# Altium schematic sheet SPI_SCH.SchDoc
size A
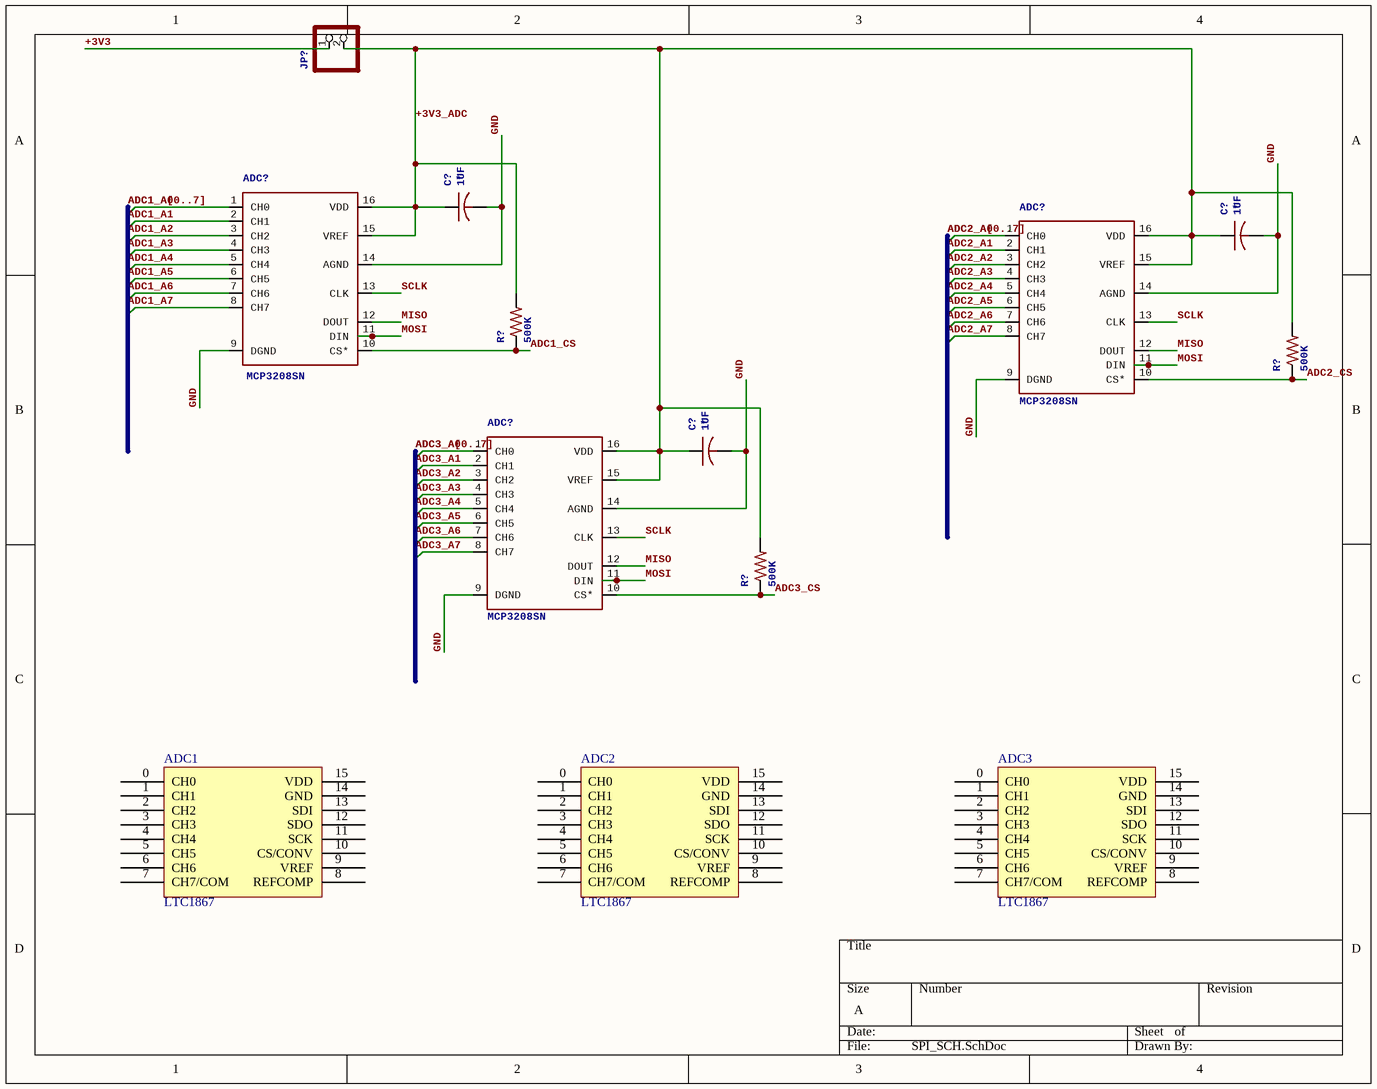
[diagram p0: SPI_SCH.SchDoc]

## Parts
(Parts that share a designator on the sheet are numbered #1, #2 ... from top to bottom, then left to right.)
ADC1  LTC1867
ADC2  LTC1867
ADC3  LTC1867
ADC?#1  MCP3208SN  [SO-16]
ADC?#2  MCP3208SN  [SO-16]
ADC?#3  MCP3208SN  [SO-16]
C?#1  1UF  [C0805]
C?#2  1UF  [C0805]
C?#3  1UF  [C0805]
JP?  PINHD-1X2  [1X02]  (value not drawn)
R?#1  500K  [R0805]
R?#2  500K  [R0805]
R?#3  500K  [R0805]

## Nets
+3V3: JP?.1
+3V3_ADC: ADC?#1.15(VREF) ADC?#1.16(VDD) ADC?#2.15(VREF) ADC?#2.16(VDD) ADC?#3.15(VREF) ADC?#3.16(VDD) C?#1.1 C?#2.1 C?#3.1 JP?.2 R?#1.2 R?#2.2 R?#3.2
ADC1_CS: ADC?#1.10(CS*) R?#1.1
ADC2_CS: ADC?#2.10(CS*) R?#2.1
ADC3_CS: ADC?#3.10(CS*) R?#3.1
GND: ADC?#1.9(DGND) ADC?#1.14(AGND) ADC?#2.9(DGND) ADC?#2.14(AGND) ADC?#3.9(DGND) ADC?#3.14(AGND) C?#1.2 C?#2.2 C?#3.2
MISO: ADC?#1.12(DOUT) ADC?#2.12(DOUT) ADC?#3.12(DOUT)
MOSI: ADC?#1.11(DIN) ADC?#2.11(DIN) ADC?#3.11(DIN)
SCLK: ADC?#1.13(CLK) ADC?#2.13(CLK) ADC?#3.13(CLK)

Not connected (* = marked no-connect by the designer): ADC1 0(CH0) 1(CH1) 2(CH2) 3(CH3) 4(CH4) 5(CH5) 6(CH6) 7(CH7/COM) 8(REFCOMP) 9(VREF) 10(CS/CONV) 11(SCK) 12(SDO) 13(SDI) 14(GND) 15(VDD); ADC2 0(CH0) 1(CH1) 2(CH2) 3(CH3) 4(CH4) 5(CH5) 6(CH6) 7(CH7/COM) 8(REFCOMP) 9(VREF) 10(CS/CONV) 11(SCK) 12(SDO) 13(SDI) 14(GND) 15(VDD); ADC3 0(CH0) 1(CH1) 2(CH2) 3(CH3) 4(CH4) 5(CH5) 6(CH6) 7(CH7/COM) 8(REFCOMP) 9(VREF) 10(CS/CONV) 11(SCK) 12(SDO) 13(SDI) 14(GND) 15(VDD); ADC?#1 1(CH0) 2(CH1) 3(CH2) 4(CH3) 5(CH4) 6(CH5) 7(CH6) 8(CH7); ADC?#2 1(CH0) 2(CH1) 3(CH2) 4(CH3) 5(CH4) 6(CH5) 7(CH6) 8(CH7); ADC?#3 1(CH0) 2(CH1) 3(CH2) 4(CH3) 5(CH4) 6(CH5) 7(CH6) 8(CH7)

## Buses and harness runs
bus ADC1_A0 = ADC1_A1 = ADC1_A2 = ADC1_A3 = ADC1_A4 = ADC1_A5 = ADC1_A6 = ADC1_A7 = ADC1_A[0..7]
bus ADC2_A0 = ADC2_A1 = ADC2_A2 = ADC2_A3 = ADC2_A4 = ADC2_A5 = ADC2_A6 = ADC2_A7 = ADC2_A[0..7]
bus ADC3_A0 = ADC3_A1 = ADC3_A2 = ADC3_A3 = ADC3_A4 = ADC3_A5 = ADC3_A6 = ADC3_A7 = ADC3_A[0..7]

## Library data of the parts
ADC1-ADC3 = LTC1867: Analog to Digital Converters - ADC 16-bit, 8-ch. Serial, Micropower ADC; ComponentLink1Description: LTC1867; ComponentLink1URL: https://www.mouser.com/ProductDetail/Analog-Devices-Linear-Technology/LTC1867CGNPBF?qs=sGAEpiMZZMvTvDTV69d2QmBn0BVuX5FEarpcve2605Y%3D
ADC?#1-ADC?#3 = MCP3208SN: 2.7V Dual Channel 12-Bit A/D Converter with SPI Serial InterfaceSource: http://ww1.microchip.com/downloads/en/DeviceDoc/21034D.pdf; MPN: MCP3202-CI/SN; GateName_1: P; DeviceName: SN; SymbolName_1: MCP3208; LibraryName: microchip-extra; DeviceSetName: MCP3208; MF: MICROCHIP; OC_FARNELL: 1196803; OC_NEWARK: 19C7207
C?#1-C?#3 = C-USC0805: CAPACITOR, American symbol; GateName_1: G$1; SymbolName_1: C-US; DeviceName: C0805; LibraryName: rcl; DeviceSetName: C-US; NAME: *; SPICEPREFIX: C
JP? = PINHD-1X2: PIN HEADER; GateName_1: G$1; SymbolName_1: PINHD2; LibraryName: pinhead; DeviceSetName: PINHD-1X2
R?#1-R?#3 = R-US_R0805: RESISTOR, American symbol; GateName_1: G$1; SymbolName_1: R-US; DeviceSetName: R-US_; DeviceName: R0805; LibraryName: rcl